# EAGLE design serlcd841 (EAGLE 7.1.0)
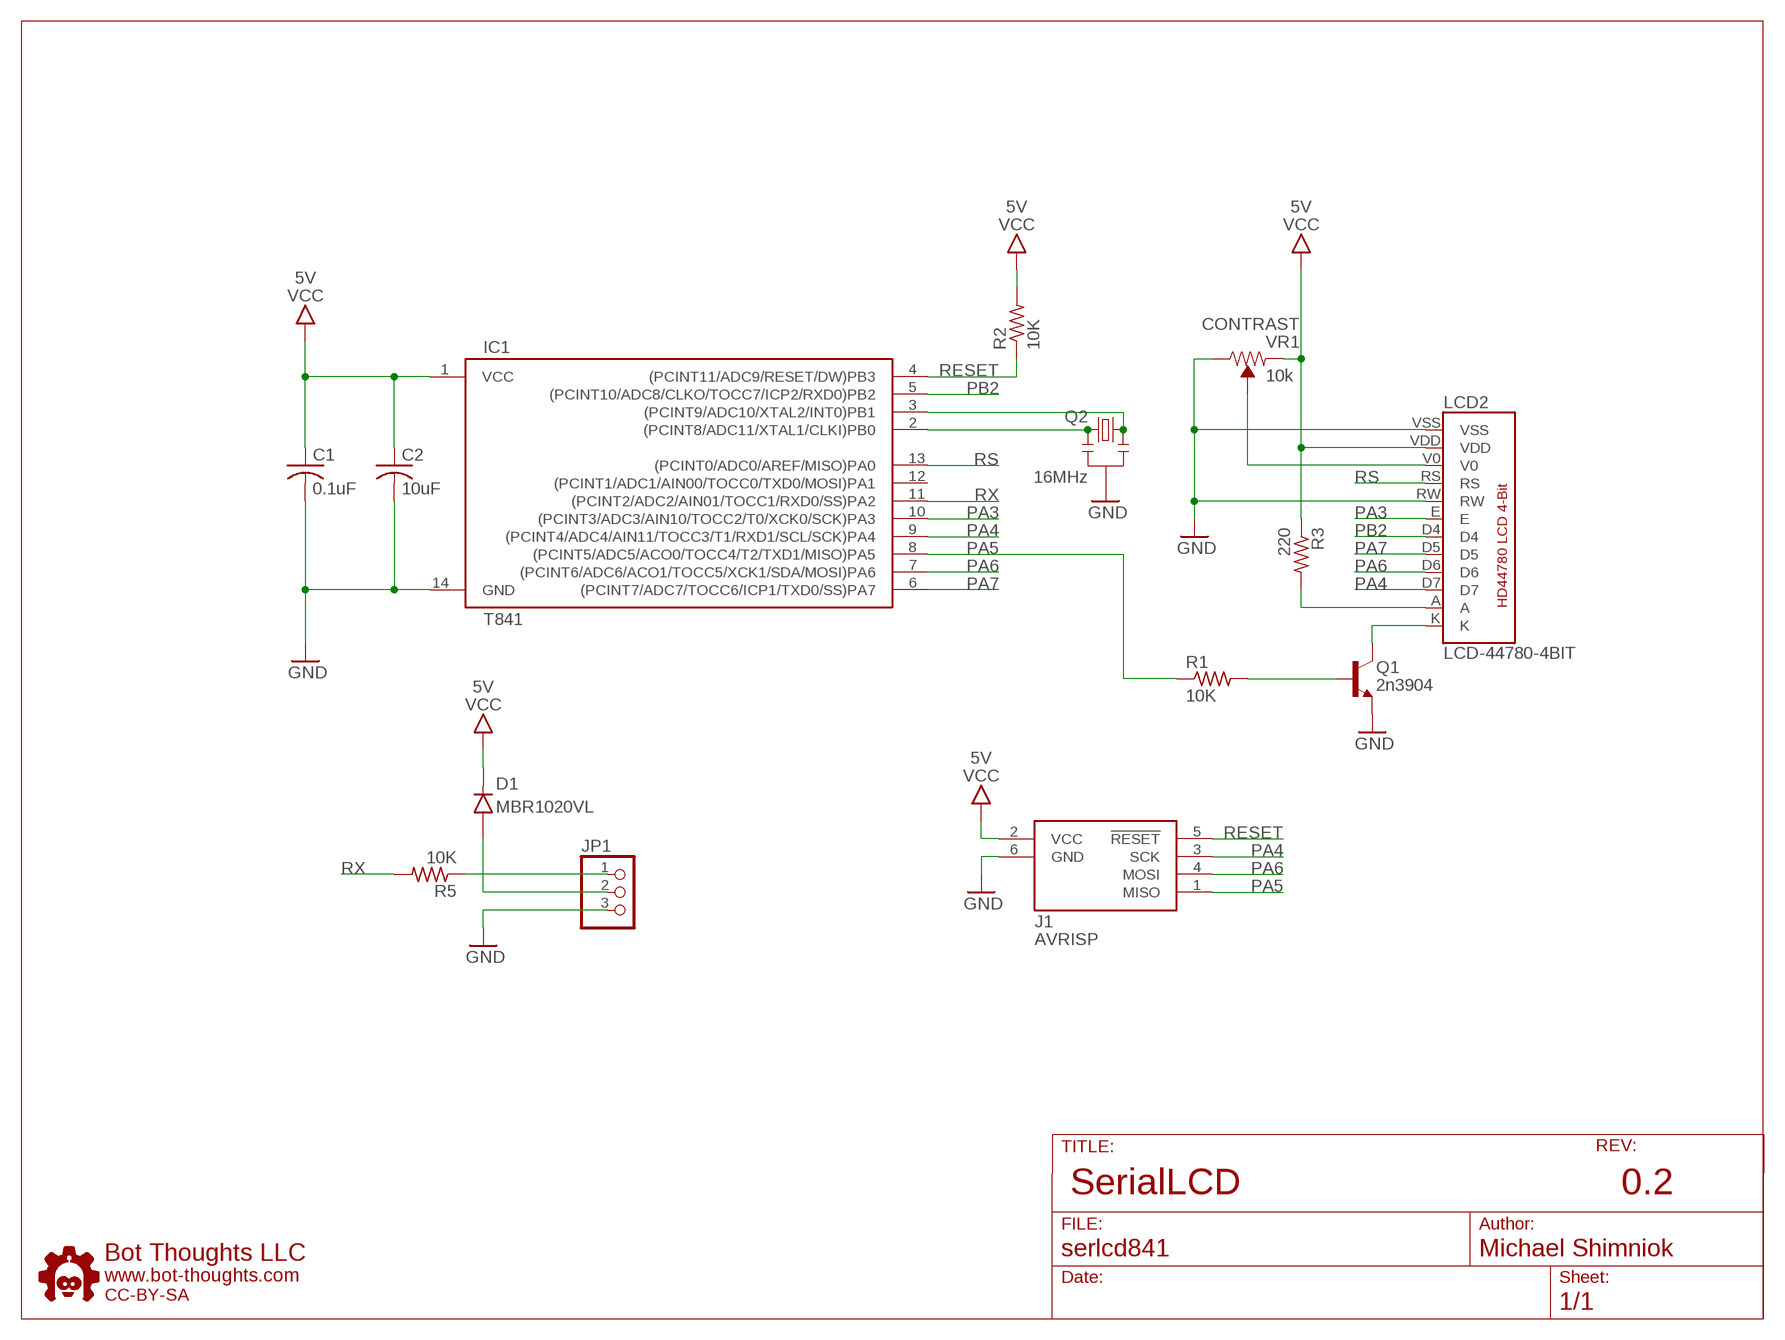
[diagram p0: schematic, sheet 1]

## Parts
C1  0.1uF  C-0603  [0603]
C2  10uF  C-1206  [1206]
D1  MBR1020VL  DIODE_SOD123FL  [SOD123FL]
IC1  T841  ATTINY441/841-SSU  [SOIC14N]
J1  AVRISP  AVRISP6_COMPACT  [CON6P2R]
JP1  PINHD-1X03_2.54-S  [1X03-S]
LCD2  LCD-44780-4BIT  [LCD16SIP]
Q1  2n3904  BJT-NPNSOT23  [SOT-23]
Q2  16MHz  RESONATOR_CSTCE_V_C  [CSTCE_V_C]
R1  10K  R0603  [0603]
R2  10K  R0603  [0603]
R3  220  R0603  [0603]
R5  10K  R0603  [0603]
U$6  BTLOGO-LOGO-MD  [BTLOGOM]
VR1  10k  TRIMPOT-SMD-3MM-OPEN-1/10W-25%  [TRIMPOT-SMD-TC33X]

## Nets
A: LCD2.A R3.2
GND: C1.2(-) C2.2(-) IC1.14(GND) J1.6(GND) JP1.3 LCD2.RW LCD2.VSS Q1.2(E) Q2.GND VR1.1(CW)
N$1: D1.A JP1.2
N$2: IC1.2((PCINT8/ADC11/XTAL1/CLKI)PB0) Q2.X2
N$3: IC1.3((PCINT9/ADC10/XTAL2/INT0)PB1) Q2.X1
N$4: Q1.3(B) R1.2
N$5: LCD2.K Q1.1(C)
PA3: IC1.10((PCINT3/ADC3/AIN10/TOCC2/T0/XCK0/SCK)PA3) LCD2.E
PA4: IC1.9((PCINT4/ADC4/AIN11/TOCC3/T1/RXD1/SCL/SCK)PA4) J1.3(SCK) LCD2.D7
PA5: IC1.8((PCINT5/ADC5/ACO0/TOCC4/T2/TXD1/MISO)PA5) J1.1(MISO) R1.1
PA6: IC1.7((PCINT6/ADC6/ACO1/TOCC5/XCK1/SDA/MOSI)PA6) J1.4(MOSI) LCD2.D6
PA7: IC1.6((PCINT7/ADC7/TOCC6/ICP1/TXD0/SS)PA7) LCD2.D5
PB2: IC1.5((PCINT10/ADC8/CLKO/TOCC7/ICP2/RXD0)PB2) LCD2.D4
RESET: IC1.4((PCINT11/ADC9/RESET/DW)PB3) J1.5(!RESET) R2.1
RS: IC1.13((PCINT0/ADC0/AREF/MISO)PA0) LCD2.RS
RX: IC1.11((PCINT2/ADC2/AIN01/TOCC1/RXD0/SS)PA2) R5.2
RXI: JP1.1 R5.1
VCC: C1.1(+) C2.1(+) D1.C IC1.1(VCC) J1.2(VCC) LCD2.VDD R2.2 R3.1 VR1.3(CCW) ; supply symbol labelled 5V
VO: LCD2.V0 VR1.2(WIPER)
Unconnected: IC1.12((PCINT1/ADC1/AIN00/TOCC0/TXD0/MOSI)PA1)

## Notes on the sheet
- CONTRAST
- SerialLCD | 0.2

## Library data of the parts
C1 C2 = bt_rcl:C: Capacitor, non-polarized, American symbol
D1 = bt_diode:DIODE: Diode Collection of generic diodes in various packages
IC1 = bt_avr:ATTINY441/841: ATtiny441, ATtiny841 AVR Microcontroller The high-performance Atmel picoPower 8-bit AVR RISC-based microcontroller combines 4KB ISP flash memory, 512-Byte EEPROM, 128B SRAM, 12 general purpose I/O lines, 32 general purpose working registers, an 8-bit timer/counter with two PWM channels, two 16-bit timer/counters with two PWM channels, internal and external interrupts, an 12-channel 10-bit A/D converter, 2 On-chip analog comparators, 2 full duplex USARTs with Start Frame wake up from power down, master/slave SPI serial interface, slave I2C serial interface, programmable gain stage (1x, 20x, and 100x) for 12 differential ADC channel pairs, programmable watchdog timer with internal oscillator, internal calibrated oscillator, and four software selectable power saving modes. The device operates between 1.7-5.5 volts. datasheet.pdf <http://www.atmel.com/Images/Atmel-8495-8-bit-AVR-Microcontrollers-ATtiny441-ATtiny841_Datasheet.pdf>
J1 = bt_avr:AVRISP6: 6-pin dual-row connector for Atmel AVRISP programmer interface
JP1 = pinhead-2:PINHD-1X03: PIN HEADER
LCD2 = bt_display:LCD-44780-4BIT: HD44780 LCD in 4-Bit mode HD44780-based LCD screen (e.g., 16x2, 40x4, ...) in 4-bit mode, using only D4:D5.
Q1 = bt_transistor:BJT-NPN: NPN Transistor Small signal NPN Bipolar Junction Transistor (BJT). Use this device to represent any of a number of such transistors with similar package and pinout: 2N4401, 2N3904, 2N2222, etc.
Q2 = bt_crystal:RESONATOR: Crystal Resonator, 3-pin
R1-R3 R5 = bt_rcl:R: Resistor, American symbol
U$6 = bt:BTLOGO: Bot Thoughts Logo
VR1 = SparkFun-Resistors:TRIMPOT: Trimming Potentiometer (Trimpot) Three-terminal potentiometers, with an adjustable wiper and two adjustable resistors. A pot can be used to create a configurable voltage divider, or as a variable resistor. "Trimpots" are a subset of potentiometers, usually intended for "set-and-forget" applications. They're often more delicate than standard potentiometers - rated for fewer turns. Variants PTH-KNOB - PTH Trimpot w/ finger-adjustable knob Trimpot 10K with Knob <https://www.sparkfun.com/products/9806> (COM-09806) Datasheet <http://www.sparkfun.com/datasheets/Components/General/TSR-3386.pdf> SMD-3MM-CLOSED-FRAME - SMD 3mm Square Closed-Frame Trimpot Used on e.g. EasyDriver - Stepper Motor Driver <https://www.sparkfun.com/products/12779> Datasheet <http://www.bitechnologies.com/pdfs/22.pdf> (22AR10KTR) SMD-5MM - SMD 5mm Square Closed-Frame Trimpot Used on e.g. IOIO-OTG - V2.2 <https://www.sparkfun.com/products/13613> Datasheet <http://www.vishay.com/docs/51008/ts53.pdf> (TS53YL502MR10) SMD-3MM-1/10W-25% - 3mm Square Open-Frame Trimpot Used on e.g. SparkFun Shapeoko <https://www.sparkfun.com/products/13899> Datasheet <http://www.bourns.com/docs/Product-Datasheets/TC33.pdf> (TC33X-2-103E); PROD_ID: RES-12428

## Board
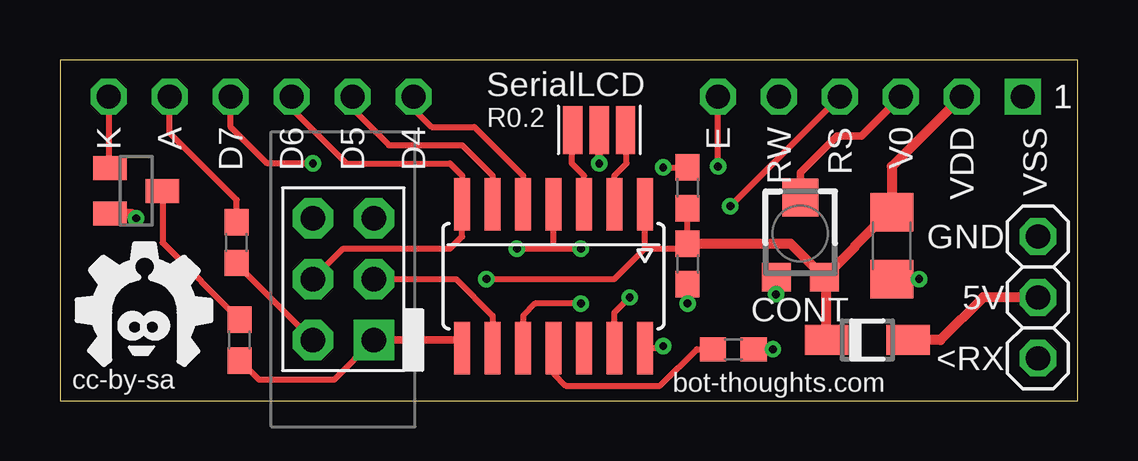
[diagram p1: board, top side]
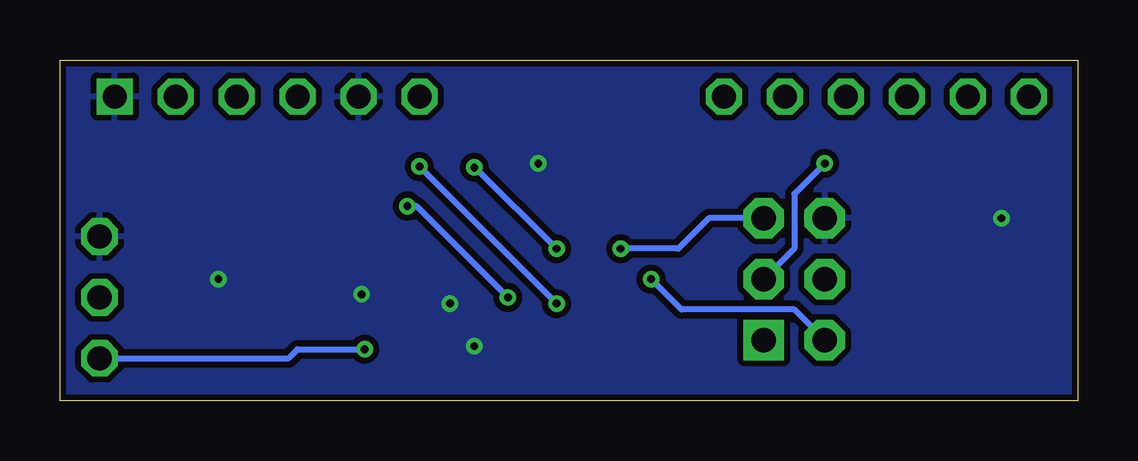
[diagram p2: board, bottom side, seen from below]

Size 42.42 x 14.22 mm. Coordinates in mm from the lower left corner, seen from the top.
Outline: 42.42,14.22 0,14.22 0,0 42.42,0 42.42,14.22
Copper layers (1*16): Top 0.0356mm / dielectric 1.5011mm / Bottom 0.0356mm
Design rules "LaenPCBOrder *": minimum track width 6mil, minimum drill 13mil, track to track 10mil, track to pad 10mil, pad to pad 10mil, via to via 10mil, smd to smd 8mil, copper to edge 10mil, drill to drill 10mil, minimum pad ring 7mil, minimum via ring 7mil, stop-mask expansion 3mil, vias tented up to drill 20mil, thermal gap 10mil

### Footprints (pad centres in the part's own frame; a part is rotated, then mirrored left to right if it is on the bottom)
0603 = smd 1.1 x 1: 1 -0.85,0; 2 0.85,0
1206 = smd 1.6 x 1.8: 1 -1.4,0; 2 1.4,0
SOD123FL = smd 1.8 x 1.25: A 1.7,0; C -1.7,0
SOIC14N = smd 0.66 x 2.2: 1 -3.81,-3; 2 -2.54,-3; 3 -1.27,-3; 4 0,-3; 5 1.27,-3; 6 2.54,-3; 7 3.81,-3; 8 3.81,3; 9 2.54,3; 10 1.27,3; 11 0,3; 12 -1.27,3; 13 -2.54,3; 14 -3.81,3
CON6P2R = drill 1.016 pad 1.676 square: 1 -2.54,-1.27 | drill 1.016 pad 1.676 octagon: 2 -2.54,1.27; 3 0,-1.27; 4 0,1.27; 5 2.54,-1.27; 6 2.54,1.27
1X03-S = drill 1.016 octagon: 1 -2.54,0; 2 0,0; 3 2.54,0
LCD16SIP = drill 1 octagon: A 35.56,0; D4 25.4,0; D5 27.94,0; D6 30.48,0; D7 33.02,0; E 12.7,0; K 38.1,0; RS 7.62,0; RW 10.16,0; V0 5.08,0; VDD 2.54,0 | drill 1 square: VSS 0,0
SOT-23 = smd 1 x 1.4: 1 -0.95,-1.1; 2 0.95,-1.1; 3 0,1.1
CSTCE_V_C = smd 0.8 x 2: GND 0,0; X1 -1.1,0; X2 1.1,0
TRIMPOT-SMD-TC33X = smd 1.2 x 1.2: 1 -1,-1.825; 3 1,-1.825 | smd 1.5 x 1.6: 2 0,1.5

### Placement (x,y rotation side)
C1  26.16,5.71 270 top
C2  34.67,6.48 270 top
D1  33.66,2.54 0 top
IC1  20.57,5.21 180 top
J1  11.81,5.08 90 top
JP1  40.77,4.32 90 top
LCD2  40.13,12.7 180 top
Q1  3.17,8.76 270 top
Q2  22.48,11.3 0 top
R1  7.49,2.54 90 top
R2  26.16,8.89 270 top
R3  7.37,6.6 90 top
R5  28.07,2.16 180 top
U$6  3.43,1.27 0 top
VR1  30.86,6.99 0 top

### Tracks (layer width: path | path; a pad name or v marks a point on that pad's centre or on a via)
A
  Top 0.254: R3.2 7.37,8.38 4.57,11.18 LCD2.A
GND  (via drill 0.33)
  Top 0.254: IC1.14 25.07,2.21 v25.15,2.29 | v29.84,4.45 29.84,4.89 VR1.1 | v26.16,4.06 C1.2
  Top 0.305: Q2.GND v22.48,9.91
  Top 0.406: Q1.2 2.98,7.81 v3.17,7.62 | C2.2 v35.81,5.08
  Bottom 0.406: 40.26,6.99 JP1.3
  pour Bottom: 42.42,14.22 42.42,0 0,0 0,14.22
N$1
  Top 0.406: JP1.2 38.48,4.32 36.7,2.54 D1.A
N$2
  Top 0.254: IC1.2 23.11,9.4 23.62,9.91 23.62,11.26 Q2.X2
N$3
  Top 0.254: IC1.3 21.84,9.4 21.34,9.91 21.34,11.26 Q2.X1
N$4
  Top 0.254: Q1.3 4.28,6.61 R1.2
N$5
  Top 0.254: LCD2.K 2.03,9.76
  Top 0.406: 2.03,9.76 Q1.1
PA3  (via drill 0.33)
  Top 0.254: v21.72,4.06 19.81,4.06 19.3,3.56 IC1.10 | v27.43,9.78 LCD2.E
  Bottom 0.254: v27.43,9.78 v21.72,4.06
PA4  (via drill 0.33)
  Top 0.254: J1.3 16.51,5.08 18.03,3.56 IC1.9 | v10.54,9.91 8.64,9.91 7.11,11.43 LCD2.D7
  Bottom 0.254: v10.54,9.91 11.81,8.64 11.81,6.35 J1.3
PA5
  Top 0.254: J1.1 11.43,0.89 8.29,0.89 R1.1
  Top 0.305: IC1.8 16.76,2.54 J1.1
PA6
  Top 0.254: LCD2.D6 9.65,12.19 11.94,9.91 16.26,9.91 16.76,9.4 IC1.7 16.76,6.86 16.26,6.35 11.81,6.35 J1.4
PA7
  Top 0.254: IC1.6 18.03,9.4 16.76,10.67 13.72,10.67 12.19,12.2 LCD2.D5
PB2
  Top 0.254: IC1.5 19.3,9.4 17.27,11.43 15.49,11.43 14.73,12.2 LCD2.D4
RESET  (via drill 0.33)
  Top 0.254: 20.57,6.35 v21.72,6.35 | v25.15,9.74 26.07,9.74 26.16,9.91 R2.1 | v19.05,6.35 20.57,6.35 | 20.57,6.35 IC1.4
  Bottom 0.254: v21.72,6.35 25.11,9.74 v25.15,9.74 | J1.5 15.37,7.62 16.64,6.35 v19.05,6.35
RS  (via drill 0.33)
  Top 0.254: IC1.13 23.11,3.68 v23.75,4.32 | v27.94,8.13 LCD2.RS
  Bottom 0.254: v23.75,4.32 27.56,8.13 v27.94,8.13
RX
  Top 0.254: R5.2 26.54,2.16 25.02,0.64 21.08,0.64 20.57,1.14 IC1.11
RXI  (via drill 0.33)
  Top 0.254: v29.72,2.16 R5.1
  Bottom 0.254: JP1.1 32.89,1.78 32.51,2.16 v29.72,2.16
VCC  (via drill 0.33)
  Top 0.254: J1.2 7.37,5.71 R3.1 | v17.78,5.08 23.11,5.08 24.38,6.35 | 24.38,6.35 IC1.1 | R2.2 C1.1 25.95,6.35 24.38,6.35
  Top 0.406: D1.C 31.95,4.94 VR1.3 | LCD2.VDD 34.67,9.78 C2.1 34.55,7.88 33.15,6.48 33.15,6.45 VR1.3 | C1.1 30.46,6.57 VR1.3
  Bottom 0.254: v17.78,5.08 16.51,3.81 11.81,3.81 J1.2
VO
  Top 0.305: VR1.2 30.86,9.24 30.86,9.52 32.38,11.05 33.4,11.05 LCD2.V0

### Text on the board
tNames: SerialLCD | R0.2 | GND | CONT | 5V | cc-by-sa | <RX | bot-thoughts.com